# EAGLE schematic CFT-PB0 (EAGLE 5.11)
DRAWN_BY: Alexios; PROJECT_NAME: CFT Mini-Computer; REVISION: Rev F; SHEET_DESCRIPTION: Microcode Banking; SIMULATION_FILENAME: verification/processor-board-uC.v; URL: http://www.bedroomlan.org/cft

## Sheet 1 of 4
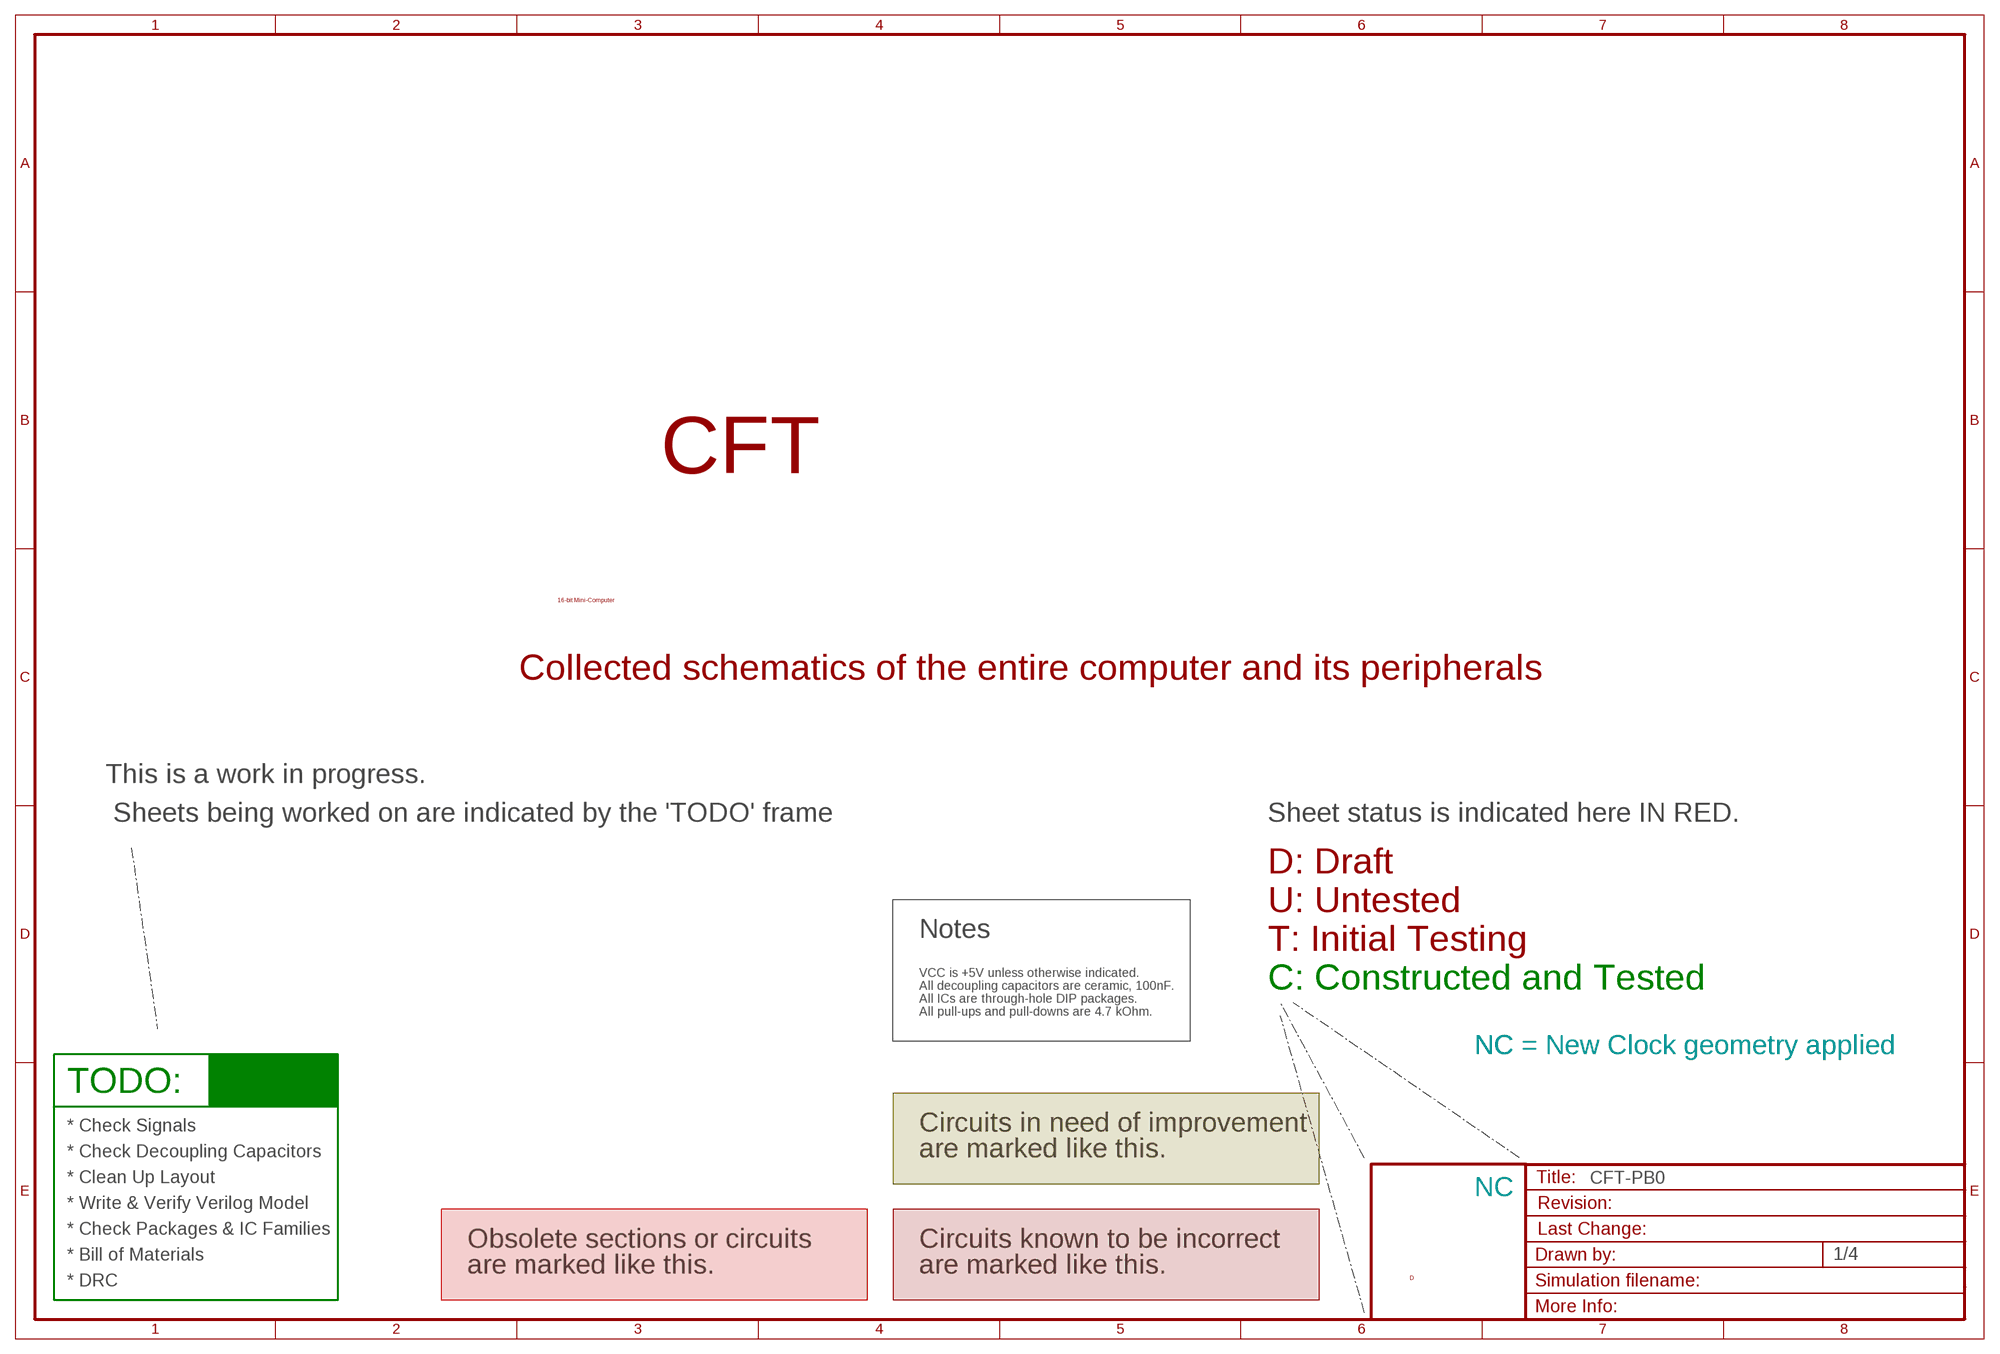
[diagram p0: schematic, sheet 1]

### Notes on the sheet
- CFT
- 16-bit Mini-Computer
- Collected schematics of the entire computer and its peripherals
- This is a work in progress.
- Sheets being worked on are indicated by the 'TODO' frame | Sheet status is indicated here IN RED.
- D: Draft
- U: Untested
- Notes
- T: Initial Testing
- VCC is +5V unless otherwise indicated.
- All decoupling capacitors are ceramic, 100nF. | C: Constructed and Tested
- All ICs are through-hole DIP packages.
- All pull-ups and pull-downs are 4.7 kOhm.
- NC | NC = New Clock geometry applied
- TODO:
- * Check Signals | Circuits in need of improvement
- * Check Decoupling Capacitors | are marked like this.
- * Clean Up Layout
- NC
- * Write & Verify Verilog Model
- * Check Packages & IC Families
- Obsolete sections or circuits | Circuits known to be incorrect
- * Bill of Materials
- are marked like this. | are marked like this.
- D
- * DRC

## Sheet 2 of 4
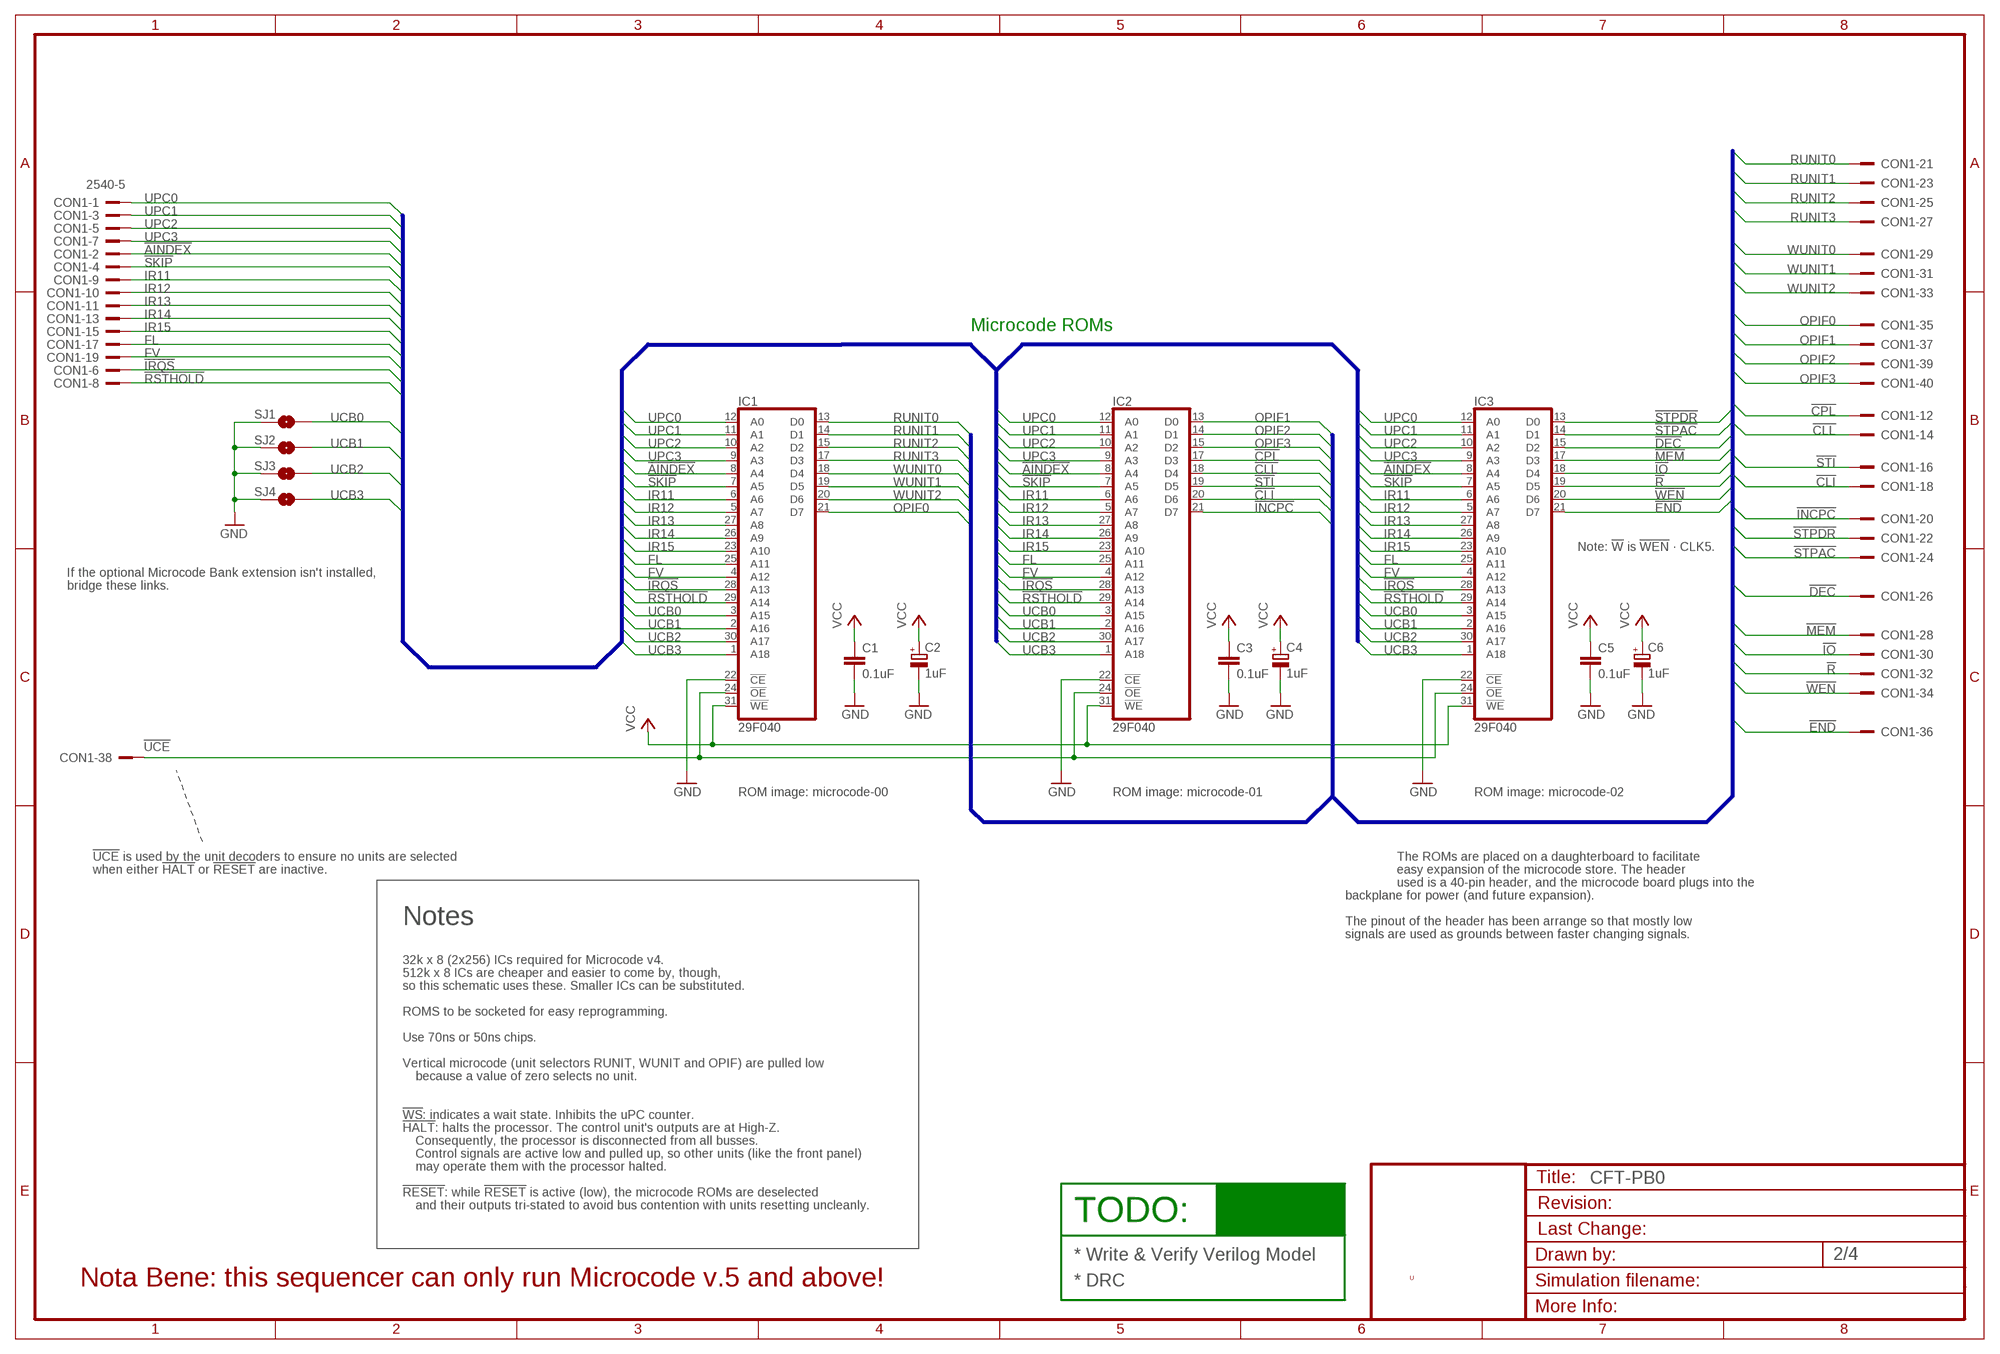
[diagram p1: schematic, sheet 2]

### Parts
C1  0.1uF  C-EUC0805K  [C0805K]
C2  1uF  CPOL-EUE2.5-5  [E2,5-5]
C3  0.1uF  C-EUC0805K  [C0805K]
C4  1uF  CPOL-EUE2.5-5  [E2,5-5]
C5  0.1uF  C-EUC0805K  [C0805K]
C6  1uF  CPOL-EUE2.5-5  [E2,5-5]
CON1  2540-5  [PAK100/2500-5-40]
IC1  29F040  29F040PLCC32  [PLCC32]
IC2  29F040  29F040PLCC32  [PLCC32]
IC3  29F040  29F040PLCC32  [PLCC32]
SJ1  SOLDERJUMPER-OLDNO  [SJ_2S-NO]
SJ2  SOLDERJUMPER-OLDNO  [SJ_2S-NO]
SJ3  SOLDERJUMPER-OLDNO  [SJ_2S-NO]
SJ4  SOLDERJUMPER-OLDNO  [SJ_2S-NO]

### Nets
!AINDEX: CON1.2 IC1.8(A4) IC2.8(A4) IC3.8(A4)
!CLI: CON1.18 IC2.20(D6)
!CLL: CON1.14 IC2.18(D4)
!CPL: CON1.12 IC2.17(D3)
!DEC: CON1.26 IC3.15(D2)
!END: CON1.36 IC3.21(D7) ; also sheet 3
!INCPC: CON1.20 IC2.21(D7)
!IO: CON1.30 IC3.18(D4) ; also sheet 4
!IRQS: CON1.6 IC1.28(A13) IC2.28(A13) IC3.28(A13) ; also sheet 4
!MEM: CON1.28 IC3.17(D3) ; also sheet 4
!R: CON1.32 IC3.19(D5) ; also sheet 4
!RSTHOLD: CON1.8 IC1.29(A14) IC2.29(A14) IC3.29(A14)
!SKIP: CON1.4 IC1.7(A5) IC2.7(A5) IC3.7(A5)
!STI: CON1.16 IC2.19(D5)
!STPAC: CON1.24 IC3.14(D1)
!STPDR: CON1.22 IC3.13(D0)
!UCE: CON1.38 IC1.24(!OE) IC2.24(!OE) IC3.24(!OE)
!WEN: CON1.34 IC3.20(D6)
FL: CON1.17 IC1.25(A11) IC2.25(A11) IC3.25(A11)
FV: CON1.19 IC1.4(A12) IC2.4(A12) IC3.4(A12)
GND [low power]: C1.2 C2.- C3.2 C4.- C5.2 C6.- IC1.22(!CE) IC2.22(!CE) IC3.22(!CE) SJ1.1 SJ2.1 SJ3.1 SJ4.1 ; also sheet 3,4
IR11: CON1.9 IC1.6(A6) IC2.6(A6) IC3.6(A6)
IR12: CON1.10 IC1.5(A7) IC2.5(A7) IC3.5(A7)
IR13: CON1.11 IC1.27(A8) IC2.27(A8) IC3.27(A8)
IR14: CON1.13 IC1.26(A9) IC2.26(A9) IC3.26(A9)
IR15: CON1.15 IC1.23(A10) IC2.23(A10) IC3.23(A10)
OPIF0: CON1.35 IC1.21(D7)
OPIF1: CON1.37 IC2.13(D0)
OPIF2: CON1.39 IC2.14(D1)
OPIF3: CON1.40 IC2.15(D2)
RUNIT0: CON1.21 IC1.13(D0)
RUNIT1: CON1.23 IC1.14(D1)
RUNIT2: CON1.25 IC1.15(D2)
RUNIT3: CON1.27 IC1.17(D3)
UCB0: IC1.3(A15) IC2.3(A15) IC3.3(A15) SJ1.2 ; also sheet 3
UCB1: IC1.2(A16) IC2.2(A16) IC3.2(A16) SJ2.2 ; also sheet 3
UCB2: IC1.30(A17) IC2.30(A17) IC3.30(A17) SJ3.2 ; also sheet 3
UCB3: IC1.1(A18) IC2.1(A18) IC3.1(A18) SJ4.2 ; also sheet 3
UPC0: CON1.1 IC1.12(A0) IC2.12(A0) IC3.12(A0)
UPC1: CON1.3 IC1.11(A1) IC2.11(A1) IC3.11(A1)
UPC2: CON1.5 IC1.10(A2) IC2.10(A2) IC3.10(A2)
UPC3: CON1.7 IC1.9(A3) IC2.9(A3) IC3.9(A3)
VCC [low power]: C1.1 C2.+ C3.1 C4.+ C5.1 C6.+ IC1.31(!WE) IC2.31(!WE) IC3.31(!WE) ; also sheet 3,4
WUNIT0: CON1.29 IC1.18(D4)
WUNIT1: CON1.31 IC1.19(D5)
WUNIT2: CON1.33 IC1.20(D6)

### Buses
MCINSTR:RUNIT[0..3],WUNIT[0..2],OPIF[0..3],!CPL,!CLL,!STI,!CLI,!INCPC,!STPDR,!STPAC,!DEC,!MEM,!IO,!R,!W,!END
MCADDR:UPC[0..3],!AINDEX,!SKIP,IR[11..15],FL,FV,!IRQS,!RSTHOLD
MCADDR:UPC[0..3],!AINDEX,!SKIP,IR[11..15],FL,FV,!IRQS,!RSTHOLD,UCB[0..3]

### Notes on the sheet
- Microcode ROMs
- Note: !W! is !WEN! · CLK5.
- If the optional Microcode Bank extension isn't installed,
- bridge these links.
- ROM image: microcode-00 | ROM image: microcode-01 | ROM image: microcode-02
- !UCE! is used by the unit decoders to ensure no units are selected | The ROMs are placed on a daughterboard to facilitate
- when either !HALT! or !RESET! are inactive. | easy expansion of the microcode store. The header
- used is a 40-pin header, and the microcode board plugs into the
- backplane for power (and future expansion).
- Notes | The pinout of the header has been arrange so that mostly low
- signals are used as grounds between faster changing signals.
- 32k x 8 (2x256) ICs required for Microcode v4.
- 512k x 8 ICs are cheaper and easier to come by, though,
- so this schematic uses these. Smaller ICs can be substituted.
- ROMS to be socketed for easy reprogramming.
- Use 70ns or 50ns chips.
- Vertical microcode (unit selectors RUNIT, WUNIT and OPIF) are pulled low
- because a value of zero selects no unit.
- !WS!: indicates a wait state. Inhibits the uPC counter.
- !HALT!: halts the processor. The control unit's outputs are at High-Z.
- Consequently, the processor is disconnected from all busses.
- Control signals are active low and pulled up, so other units (like the front panel)
- may operate them with the processor halted.
- !RESET!: while !RESET! is active (low), the microcode ROMs are deselected
- and their outputs tri-stated to avoid bus contention with units resetting uncleanly.
- TODO:
- * Write & Verify Verilog Model
- U
- Nota Bene: this sequencer can only run Microcode v.5 and above! | * DRC

## Sheet 3 of 4
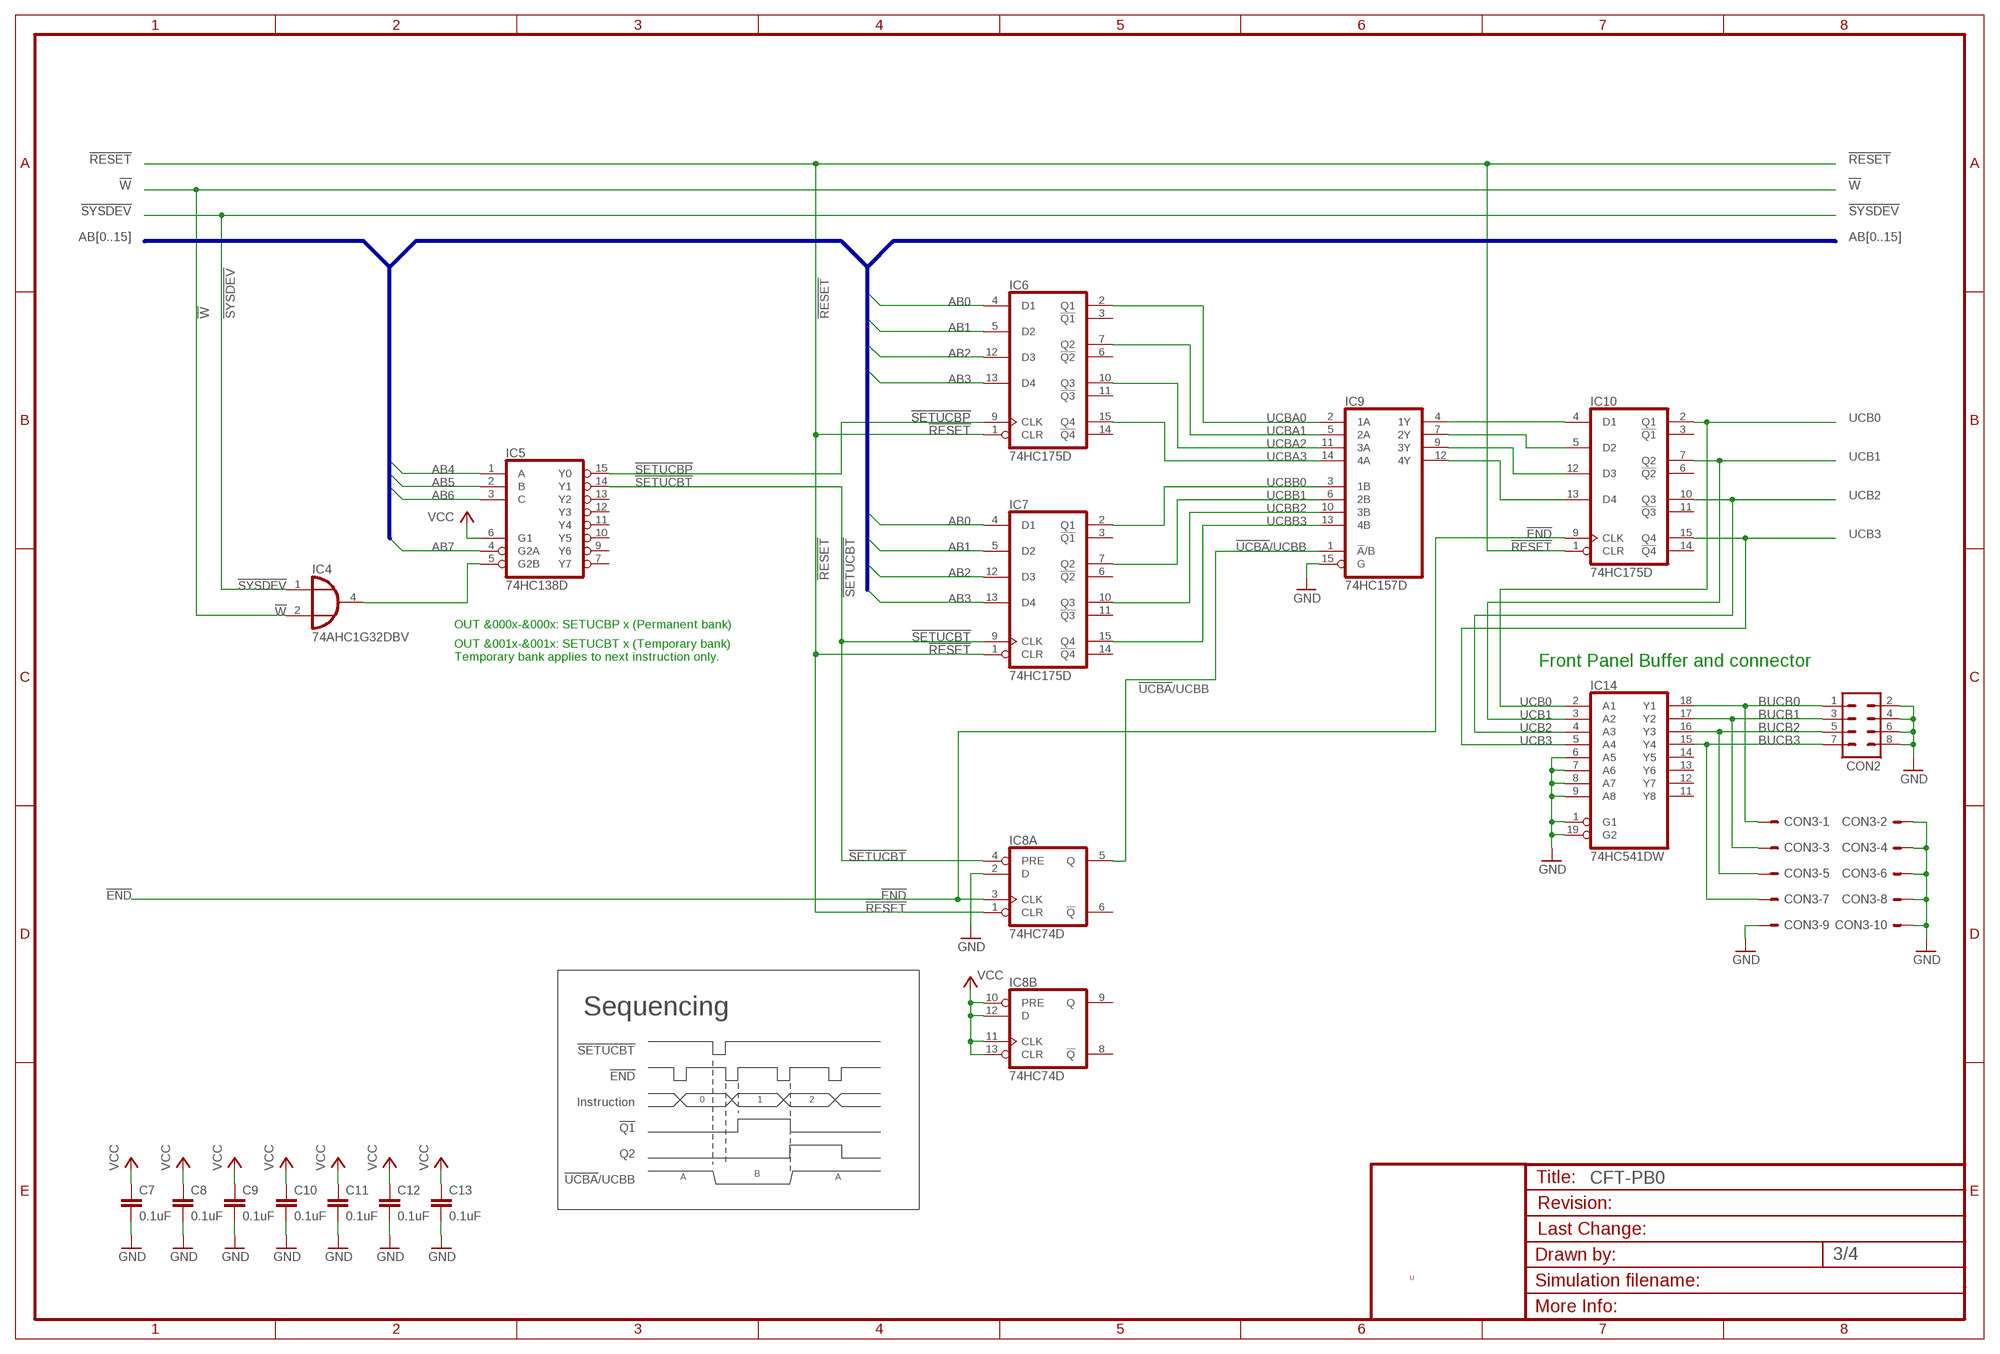
[diagram p2: schematic, sheet 3]

### Parts
C7  0.1uF  C-EUC0805K  [C0805K]
C8  0.1uF  C-EUC0805K  [C0805K]
C9  0.1uF  C-EUC0805K  [C0805K]
C10  0.1uF  C-EUC0805K  [C0805K]
C11  0.1uF  C-EUC0805K  [C0805K]
C12  0.1uF  C-EUC0805K  [C0805K]
C13  0.1uF  C-EUC0805K  [C0805K]
CON2  MA04-2  [MA04-2]
CON3  ML10LE  [ML10L]
IC4  74AHC1G32DBV  [SOT23-5]
IC5  74HC138D  [SO16]
IC6  74HC175D  [SO16]
IC7  74HC175D  [SO16]
IC8  74HC74D  [SO14]
IC9  74HC157D  74HC157/ALT-D  [SO16]
IC10  74HC175D  [SO16]
IC14  74HC541DW  [SO20W]

### Nets
!END: IC8.3(A:CLK) IC10.9(CLK) ; also sheet 2
!RESET: IC6.1(CLR) IC7.1(CLR) IC8.1(A:CLR) IC10.1(CLR) ; also sheet 4
!SETUCBP: IC5.15(Y0) IC6.9(CLK)
!SETUCBT: IC5.14(Y1) IC7.9(CLK) IC8.4(A:PRE)
!SYSDEV: IC4.1(I0) ; also sheet 4
!UCBA!/UCBB: IC8.5(A:Q) IC9.1(!A!/B)
!W: IC4.2(I1) ; also sheet 4
AB0: IC6.4(D1) IC7.4(D1) ; also sheet 4
AB1: IC6.5(D2) IC7.5(D2) ; also sheet 4
AB2: IC6.12(D3) IC7.12(D3) ; also sheet 4
AB3: IC6.13(D4) IC7.13(D4) ; also sheet 4
AB4: IC5.1(A) ; also sheet 4
AB5: IC5.2(B) ; also sheet 4
AB6: IC5.3(C) ; also sheet 4
AB7: IC5.4(G2A) ; also sheet 4
BUCB0: CON2.1 CON3.1 IC14.18(Y1)
BUCB1: CON2.3 CON3.3 IC14.17(Y2)
BUCB2: CON2.5 CON3.5 IC14.16(Y3)
BUCB3: CON2.7 CON3.7 IC14.15(Y4)
GND [low power]: C7.2 C8.2 C9.2 C10.2 C11.2 C12.2 C13.2 CON2.2 CON2.4 CON2.6 CON2.8 CON3.2 CON3.4 CON3.6 CON3.8 CON3.9 CON3.10 IC8.2(A:D) IC9.15(G) IC14.1(G1) IC14.6(A5) IC14.7(A6) IC14.8(A7) IC14.9(A8) IC14.19(G2) ; also sheet 2,4
N$1: IC4.4(O) IC5.5(G2B)
N$2: IC9.4(1Y) IC10.4(D1)
N$3: IC9.7(2Y) IC10.5(D2)
N$4: IC9.9(3Y) IC10.12(D3)
N$5: IC9.12(4Y) IC10.13(D4)
UCB0: IC10.2(Q1) IC14.2(A1) ; also sheet 2
UCB1: IC10.7(Q2) IC14.3(A2) ; also sheet 2
UCB2: IC10.10(Q3) IC14.4(A3) ; also sheet 2
UCB3: IC10.15(Q4) IC14.5(A4) ; also sheet 2
UCBA0: IC6.2(Q1) IC9.2(1A)
UCBA1: IC6.7(Q2) IC9.5(2A)
UCBA2: IC6.10(Q3) IC9.11(3A)
UCBA3: IC6.15(Q4) IC9.14(4A)
UCBB0: IC7.2(Q1) IC9.3(1B)
UCBB1: IC7.7(Q2) IC9.6(2B)
UCBB2: IC7.10(Q3) IC9.10(3B)
UCBB3: IC7.15(Q4) IC9.13(4B)
VCC [low power]: C7.1 C8.1 C9.1 C10.1 C11.1 C12.1 C13.1 IC5.6(G1) IC8.10(B:PRE) IC8.11(B:CLK) IC8.12(B:D) IC8.13(B:CLR) ; also sheet 2,4
Unconnected: IC5.7(Y7) IC5.9(Y6) IC5.10(Y5) IC5.11(Y4) IC5.12(Y3) IC5.13(Y2) IC6.3(!Q1) IC6.6(!Q2) IC6.11(!Q3) IC6.14(!Q4) IC7.3(!Q1) IC7.6(!Q2) IC7.11(!Q3) IC7.14(!Q4) IC8.6(A:!Q) IC8.8(B:!Q) IC8.9(B:Q) IC10.3(!Q1) IC10.6(!Q2) IC10.11(!Q3) IC10.14(!Q4) IC14.11(Y8) IC14.12(Y7) IC14.13(Y6) IC14.14(Y5)

### Buses
AB[0..15]

### Notes on the sheet
- OUT &000x-&000x: SETUCBP x (Permanent bank)
- OUT &001x-&001x: SETUCBT x (Temporary bank)
- Temporary bank applies to next instruction only.
- Front Panel Buffer and connector
- Sequencing
- !SETUCBT
- !END
- 0 | 1 | 2
- Instruction
- !Q1
- Q2
- B
- A | A
- !UCBA!/UCBB
- U

## Sheet 4 of 4
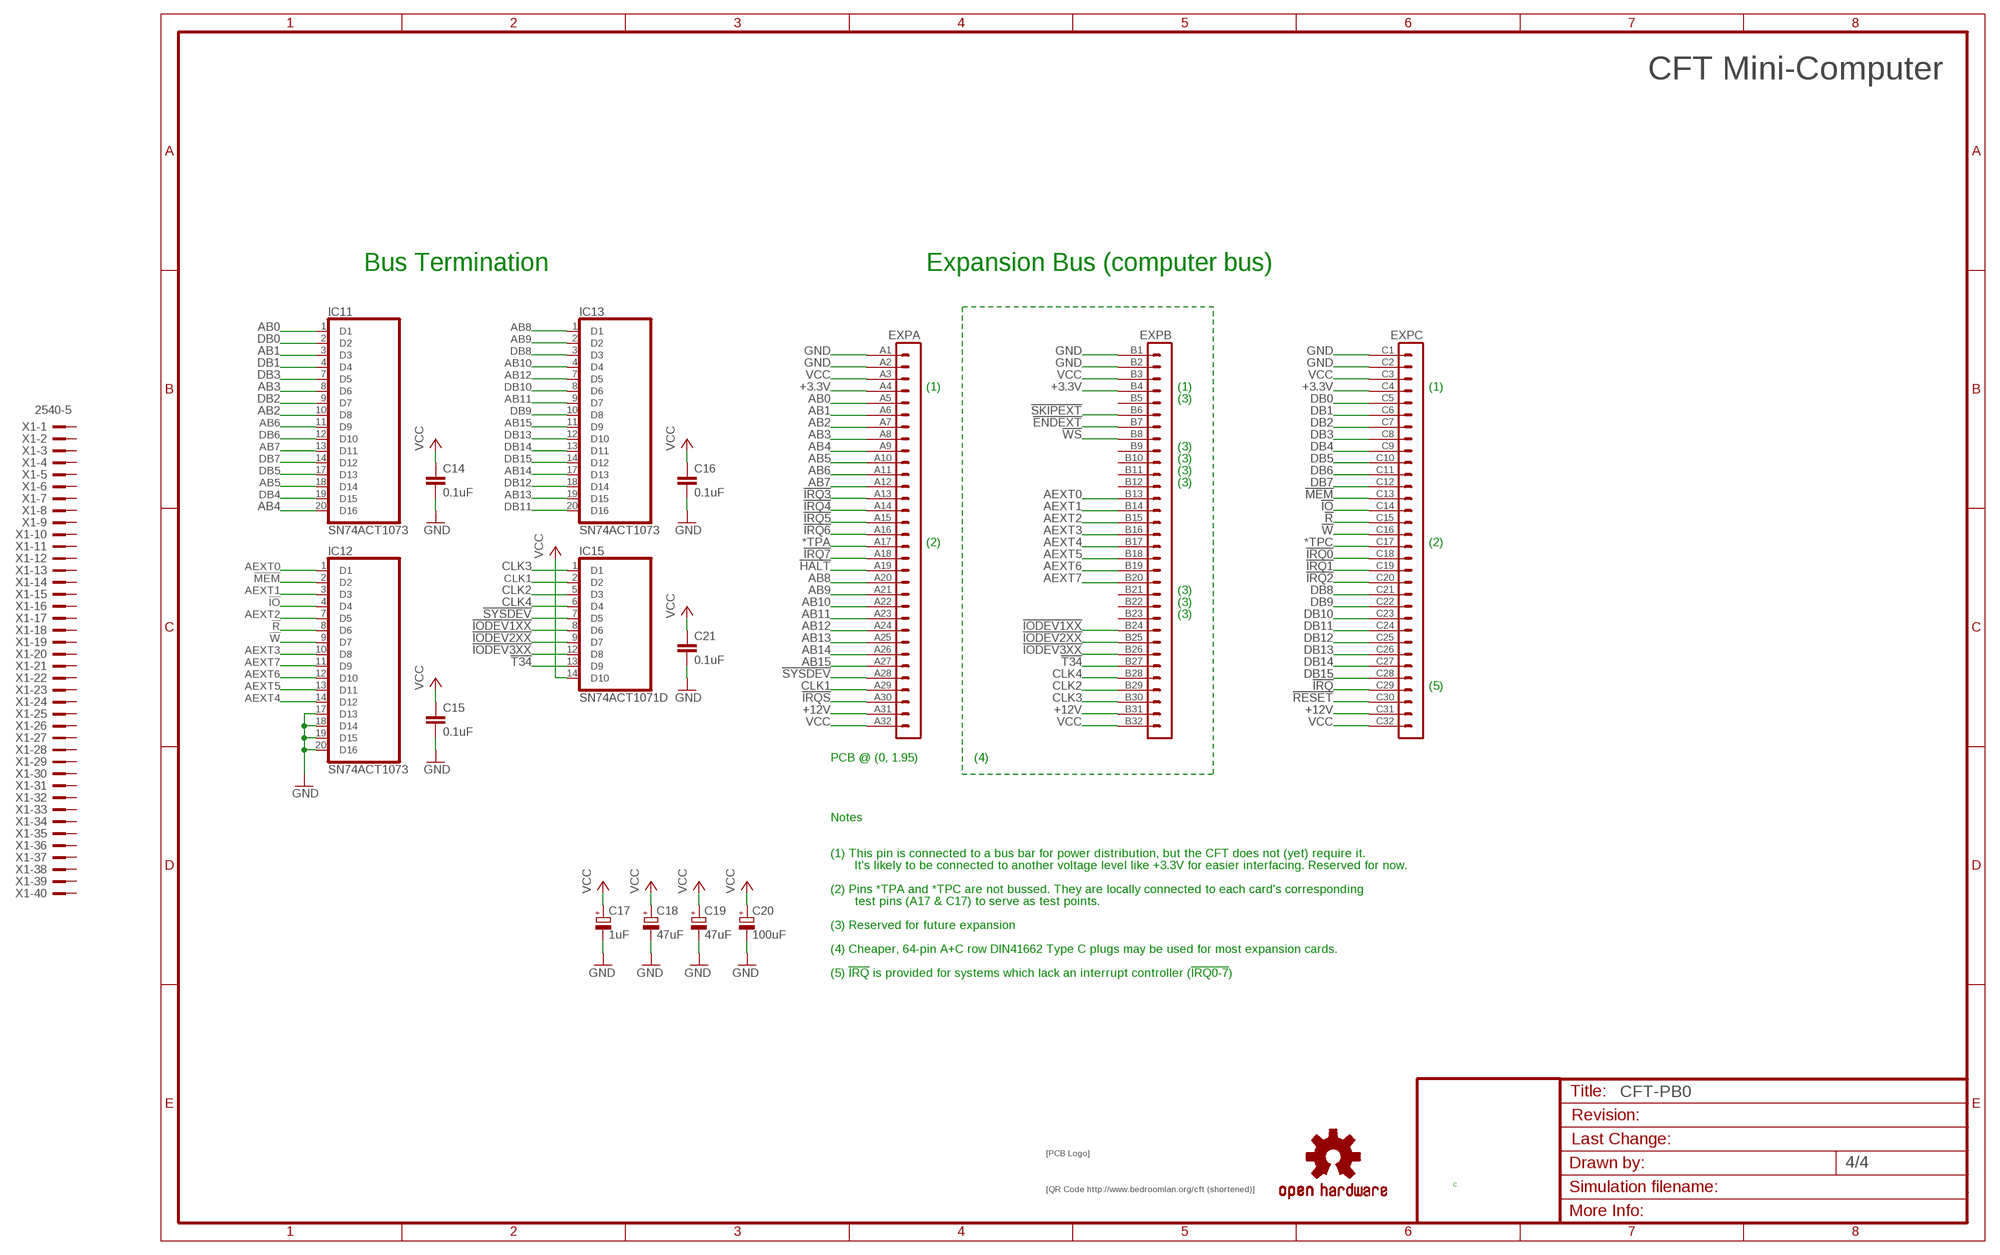
[diagram p3: schematic, sheet 4]

### Parts
$4_37_$  SIGNATURESILK  [SIGNATURE]
$4_39_$  OSHW-LOGOL  [OSHW-LOGO-L]
$4_40_$  QRCODE-CFT  [CFT-QRCODE]
C14  0.1uF  C-EUC0805K  [C0805K]
C15  0.1uF  C-EUC0805K  [C0805K]
C16  0.1uF  C-EUC0805K  [C0805K]
C17  1uF  CPOL-EUE2.5-5  [E2,5-5]
C18  47uF  CPOL-EUE2.5-5  [E2,5-5]
C19  47uF  CPOL-EUE2.5-5  [E2,5-5]
C20  100uF  CPOL-EUE2.5-7  [E2,5-7]
C21  0.1uF  C-EUC0805K  [C0805K]
EXP  VG96-3K  [VG96K]
IC11  SN74ACT1073  [SO20W]
IC12  SN74ACT1073  [SO20W]
IC13  SN74ACT1073  [SO20W]
IC15  SN74ACT1071D  [SO14]
X1  2540-5  [PAK100/2500-5-40]

### Nets
!ENDEXT: EXP.B7
!HALT: EXP.A19
!IO: EXP.C14 IC12.4(D4) ; also sheet 2
!IODEV1XX: EXP.B24 IC15.8(D6)
!IODEV2XX: EXP.B25 IC15.9(D7)
!IODEV3XX: EXP.B26 IC15.12(D8)
!IRQ: EXP.C29
!IRQ0: EXP.C18
!IRQ1: EXP.C19
!IRQ2: EXP.C20
!IRQ3: EXP.A13
!IRQ4: EXP.A14
!IRQ5: EXP.A15
!IRQ6: EXP.A16
!IRQ7: EXP.A18
!IRQS: EXP.A30 ; also sheet 2
!MEM: EXP.C13 IC12.2(D2) ; also sheet 2
!R: EXP.C15 IC12.8(D6) ; also sheet 2
!RESET: EXP.C30 ; also sheet 3
!SKIPEXT: EXP.B6
!SYSDEV: EXP.A28 IC15.7(D5) ; also sheet 3
!T34: EXP.B27 IC15.13(D9)
!W: EXP.C16 IC12.9(D7) ; also sheet 3
!WS: EXP.B8
*TPA: EXP.A17
*TPC: EXP.C17
+3.3V: EXP.A4 EXP.B4 EXP.C4
+12V [LED power]: EXP.A31 EXP.B31 EXP.C31
AB0: EXP.A5 IC11.1(D1) ; also sheet 3
AB1: EXP.A6 IC11.3(D3) ; also sheet 3
AB2: EXP.A7 IC11.10(D8) ; also sheet 3
AB3: EXP.A8 IC11.8(D6) ; also sheet 3
AB4: EXP.A9 IC11.20(D16) ; also sheet 3
AB5: EXP.A10 IC11.18(D14) ; also sheet 3
AB6: EXP.A11 IC11.11(D9) ; also sheet 3
AB7: EXP.A12 IC11.13(D11) ; also sheet 3
AB8: EXP.A20 IC13.1(D1)
AB9: EXP.A21 IC13.2(D2)
AB10: EXP.A22 IC13.4(D4)
AB11: EXP.A23 IC13.9(D7)
AB12: EXP.A24 IC13.7(D5)
AB13: EXP.A25 IC13.19(D15)
AB14: EXP.A26 IC13.17(D13)
AB15: EXP.A27 IC13.11(D9)
AEXT0: EXP.B13 IC12.1(D1)
AEXT1: EXP.B14 IC12.3(D3)
AEXT2: EXP.B15 IC12.7(D5)
AEXT3: EXP.B16 IC12.10(D8)
AEXT4: EXP.B17 IC12.14(D12)
AEXT5: EXP.B18 IC12.13(D11)
AEXT6: EXP.B19 IC12.12(D10)
AEXT7: EXP.B20 IC12.11(D9)
CLK1: EXP.A29 IC15.2(D2)
CLK2: EXP.B29 IC15.5(D3)
CLK3: EXP.B30 IC15.1(D1)
CLK4: EXP.B28 IC15.6(D4)
DB0: EXP.C5 IC11.2(D2)
DB1: EXP.C6 IC11.4(D4)
DB2: EXP.C7 IC11.9(D7)
DB3: EXP.C8 IC11.7(D5)
DB4: EXP.C9 IC11.19(D15)
DB5: EXP.C10 IC11.17(D13)
DB6: EXP.C11 IC11.12(D10)
DB7: EXP.C12 IC11.14(D12)
DB8: EXP.C21 IC13.3(D3)
DB9: EXP.C22 IC13.10(D8)
DB10: EXP.C23 IC13.8(D6)
DB11: EXP.C24 IC13.20(D16)
DB12: EXP.C25 IC13.18(D14)
DB13: EXP.C26 IC13.12(D10)
DB14: EXP.C27 IC13.13(D11)
DB15: EXP.C28 IC13.14(D12)
GND [low power]: C14.2 C15.2 C16.2 C17.- C18.- C19.- C20.- C21.2 EXP.A1 EXP.A2 EXP.B1 EXP.B2 EXP.C1 EXP.C2 IC12.17(D13) IC12.18(D14) IC12.19(D15) IC12.20(D16) ; also sheet 2,3
VCC [low power]: C14.1 C15.1 C16.1 C17.+ C18.+ C19.+ C20.+ C21.1 EXP.A3 EXP.A32 EXP.B3 EXP.B32 EXP.C3 EXP.C32 IC15.14(D10) ; also sheet 2,3
Unconnected: EXP.B5 EXP.B9 EXP.B10 EXP.B11 EXP.B12 EXP.B21 EXP.B22 EXP.B23 X1.1 X1.2 X1.3 X1.4 X1.5 X1.6 X1.7 X1.8 X1.9 X1.10 X1.11 X1.12 X1.13 X1.14 X1.15 X1.16 X1.17 X1.18 X1.19 X1.20 X1.21 X1.22 X1.23 X1.24 X1.25 X1.26 X1.27 X1.28 X1.29 X1.30 X1.31 X1.32 X1.33 X1.34 X1.35 X1.36 X1.37 X1.38 X1.39 X1.40

### Notes on the sheet
- CFT Mini-Computer
- Bus Termination | Expansion Bus (computer bus)
- (1) | (1) | (1)
- (3)
- (3)
- (3)
- (3)
- (3)
- (2) | (2)
- (3)
- (3)
- (3)
- (5)
- PCB @ (0, 1.95) | (4)
- Notes
- (1) This pin is connected to a bus bar for power distribution, but the CFT does not (yet) require it.
- It's likely to be connected to another voltage level like +3.3V for easier interfacing. Reserved for now.
- (2) Pins *TPA and *TPC are not bussed. They are locally connected to each card's corresponding
- test pins (A17 & C17) to serve as test points.
- (3) Reserved for future expansion
- (4) Cheaper, 64-pin A+C row DIN41662 Type C plugs may be used for most expansion cards.
- (5) !IRQ! is provided for systems which lack an interrupt controller (!IRQ0-7!)
- C

## Power pins joined to a net without a drawn wire
GND: IC1.16(GND) IC2.16(GND) IC3.16(GND) IC4.3(GND) IC5.8(GND) IC6.8(GND) IC7.8(GND) IC8.7(P:GND) IC9.8(GND) IC10.8(GND) IC11.5(GND) IC11.6(GND) IC12.5(GND) IC12.6(GND) IC13.5(GND) IC13.6(GND) IC14.10(GND) IC15.3(GND) IC15.4(GND)
VCC: IC1.32(VCC) IC2.32(VCC) IC3.32(VCC) IC4.5(VCC) IC5.16(VCC) IC6.16(VCC) IC7.16(VCC) IC8.14(P:VCC) IC9.16(VCC) IC10.16(VCC) IC11.15(VCC) IC11.16(VCC) IC12.15(VCC) IC12.16(VCC) IC13.15(VCC) IC13.16(VCC) IC14.20(VCC) IC15.10(VCC) IC15.11(VCC)

## Library data of the parts
$4_37_$ = alexios:SIGNATURE: Soup signature
$4_39_$ = SparkFun:OSHW-LOGO: Open Source Hardware Logo This logo indicates the piece of hardware it is found on incorporates a OSHW license and/or adheres to the definition of open source hardware found here: http://freedomdefined.org/OSHW
$4_40_$ = alexios:QRCODE-*: Various QR codes in silkscreen.
C1 C3 C5 C7-C16 C21 = rcl:C-EU: CAPACITOR, European symbol
C2 C4 C6 C17-C20 = rcl:CPOL-EU: POLARIZED CAPACITOR, European symbol
CON1 X1 = con-3m:2540-: 3M (TM) Pak 100 4-Wall Header Source: 3M; OC_FARNELL: 9838414; OC_NEWARK: unknown
CON2 = con-lstb:MA04-2: PIN HEADER; OC_FARNELL: unknown; OC_NEWARK: unknown
CON3 = con-harting-ml:ML10?E: HARTING; OC_FARNELL: unknown; OC_NEWARK: unknown
EXP = alexios-19inch:VG96-3: PCB EUROCARD, 96-pin type C/ABC, 2.54 mm
IC1-IC3 = alexios:29F040: 4-mbit (512x8) Flash memory in a PLCC32 package (with socket). AM29F040 is an example of this.
IC4 = alexios:74*1G32: 2-input OR gate
IC5 = alexios:74*138: 3-line to 8-line DECODER/DEMULTIPLEXER
IC6 IC7 IC10 = alexios:74*175: Qadruple D type FLIP FLOP, clear
IC8 = alexios:74*74: Dual D type positive edge triggered FLIP FLOP, preset and clear
IC9 = alexios:74*157/ALT-: Quadruple 2-line to 1-line data SELECTOR/MULTIPLEXER
IC11-IC13 = alexios:SN74ACT1073: SN74ACT1073 16-Bit Bus-Termination Array with Bus-Hold Function Datasheet <http://www.ti.com/lit/ds/symlink/sn74act1073.pdf>
IC14 = alexios:74*541: Octal BUFFER and LINE DRIVER, 3-state
IC15 = alexios:SN74ACT1071: 10-BIT BUS-TERMINATION ARRAY WITH BUS-HOLD FUNCTION Datasheet: http://www.ti.com/lit/ds/scas192/scas192.pdf
SJ1-SJ4 = SparkFun:SOLDERJUMPER-OLD: Solder Jumper Standard SMD solder jumper. Used to automate production. Two varients : Normally Open and Normally Closed are the same, but have different paste layers. NC will have a large amount of paste and should jumper during reflow.

## Net classes
0 default: width 0.203 mm, clearance 0.203 mm
1 low power: width 0.203 mm, clearance 0.254 mm
2 LED power: width 1.93 mm, clearance 0.254 mm